# Altium schematic sheet 3V3StepDown.SchDoc
size A4
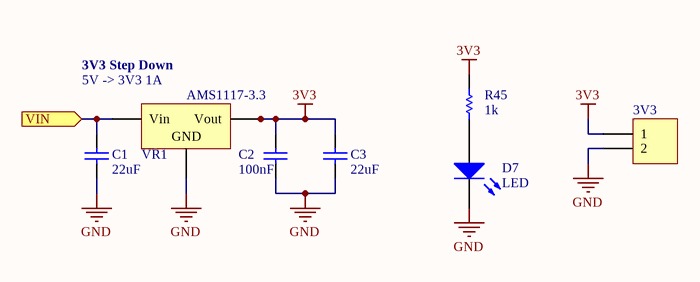
[diagram p0: 3V3StepDown.SchDoc]

## Parts
3V3  Header 2  [HDR1X2]  (value not drawn)
C1  value 22uF  [J1-0603]  (hidden comment: Cap)
C2  value 100nF  [J1-0603]  (hidden comment: Cap)
C3  value 22uF  [J1-0603]  (hidden comment: Cap)
D7  LED  [J1-0603 LED]
R45  value 1k  [J1-0603]  (hidden comment: Res1)
VR1  AMS1117-3.3  [SOT223-4M]

## Ports
VIN (in)

## Nets
3V3: 3V3.1 C2.2 C3.1 R45.2 VR1.2(Vout) VR1.4(Vout)
GND: 3V3.2 C1.2 C2.1 C3.2 D7.2(K) VR1.1(GND)
VIN: C1.1 VR1.3(Vin) ; port VIN
NetD7_1: D7.1(A) R45.1

## Notes on the sheet
- (near VR1) 3V3 Step Down
- (near VR1) 5V -> 3V3 1A

## Library data of the parts
3V3 = Header 2: Header, 2-Pin; LatestRevisionDate: 17-Jul-2002; LatestRevisionNote: Re-released for DXP Platform.; Publisher: Altium Limited
C1-C3 = Cap: Capacitor; Published: 8-Jun-2000; LatestRevisionDate: 17-Jul-2002; LatestRevisionNote: Re-released for DXP Platform.; PackageReference: RAD-0.3; Publisher: Altium Limited; PackageDescription: Radial Cap, Thru-Hole; 2 Leads; 0.3 in Pin Spacing
  C1 C3: LCSC: C109447
  C2: LCSC: C153795
R45 = Res1: Resistor; Published: 8-Jun-2000; LatestRevisionDate: 17-Jul-2002; LatestRevisionNote: Re-released for DXP Platform.; PackageReference: AXIAL-0.3; Publisher: Altium Limited; PackageDescription: Axial Device, Thru-Hole; 2 Leads; 0.3 in Pin Spacing
VR1 = Volt Reg: Voltage Regulator; Published: 24-Mar-1999; LatestRevisionDate: 29-May-2009; LatestRevisionNote: IPC-7351 Footprint Added.; PackageReference: D2PAK; Publisher: Altium Limited; PackageDescription: 3-Pin Transistor Outline Package 2.54 mm Pitch, 15.1 mm Lead Span; LCSC: C165482
D7 = LED: Published: 8-Jun-2000; LatestRevisionDate: 17-Jul-2002; LatestRevisionNote: Re-released for DXP Platform.; PackageVersion: Feb-2002; PackageReference: 3.2X1.6X1.1; Publisher: Altium Limited; PackageDescription: SM LED; 2 Flat Leads; LCSC: C205450